# EAGLE design PCI dos Motores (EAGLE 6.3)
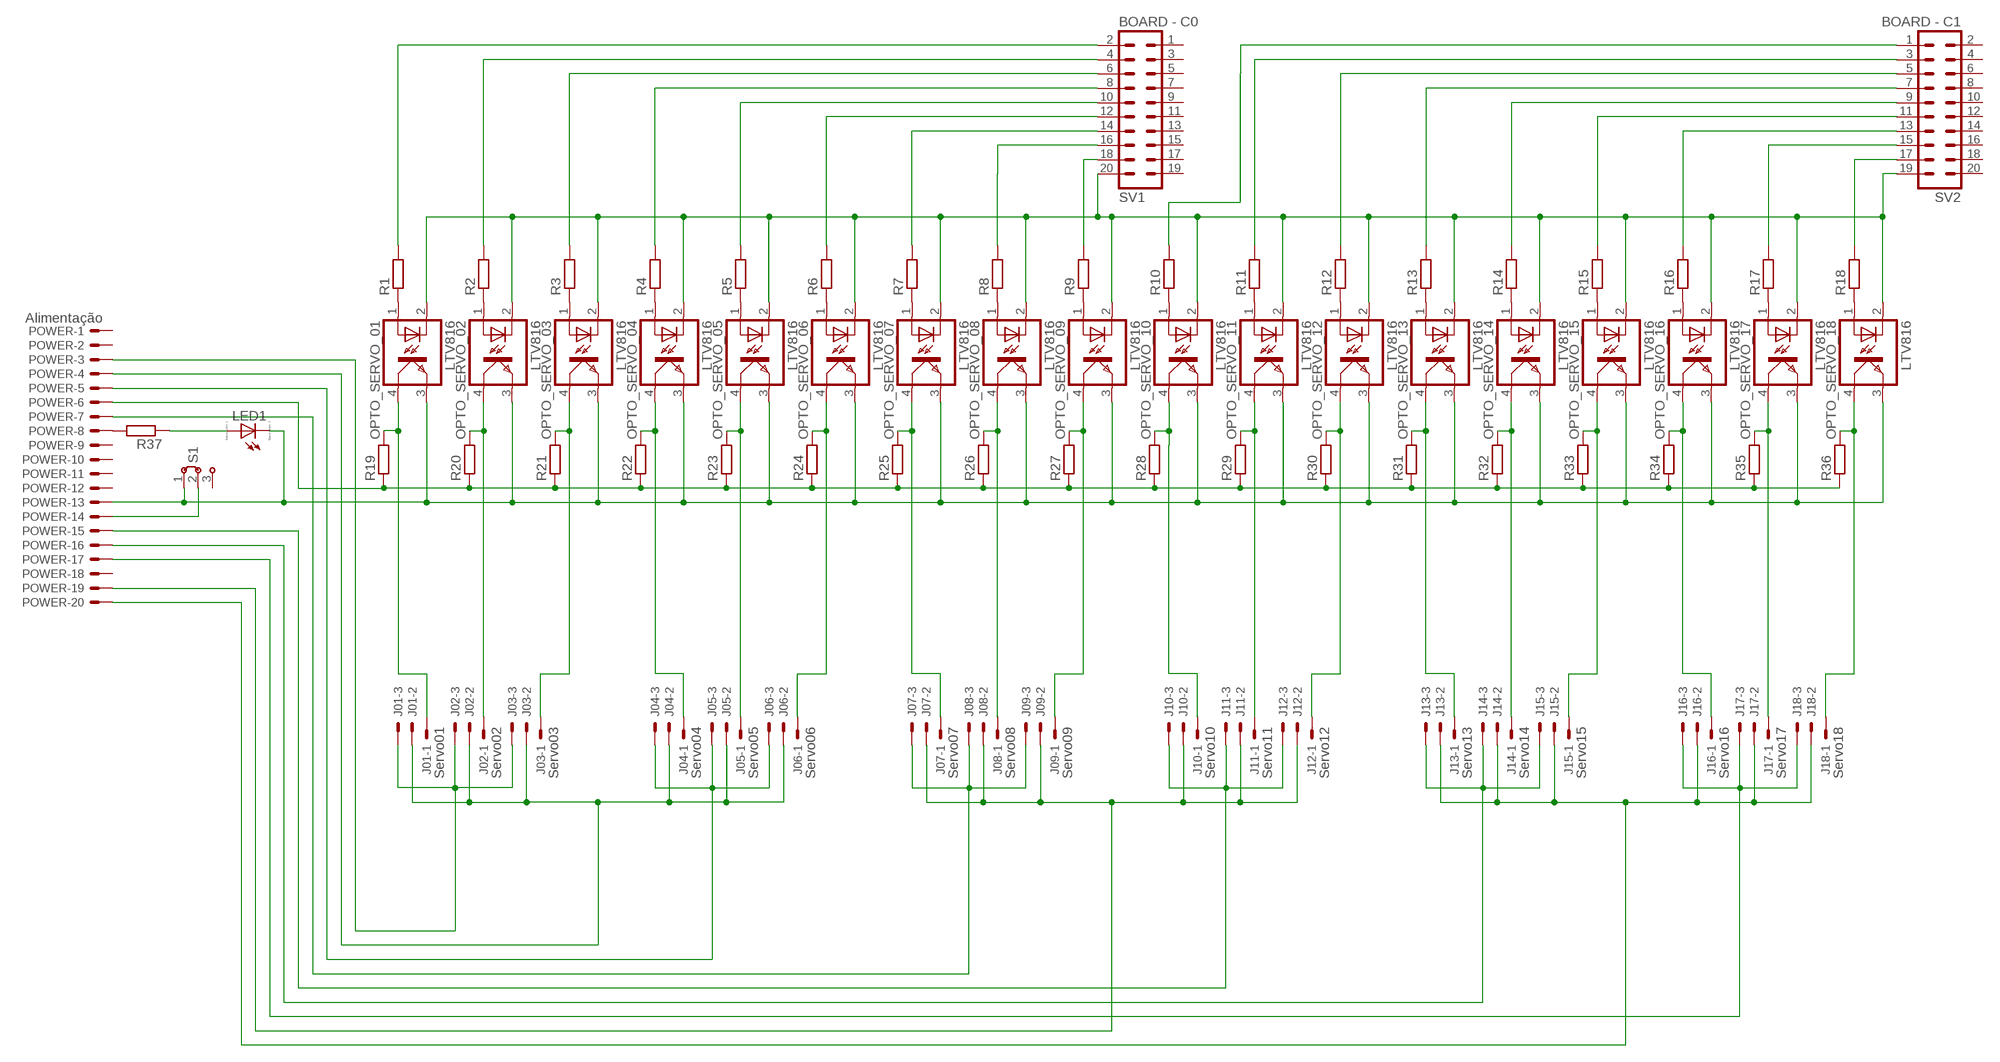
[diagram p0: schematic, sheet 1]

## Parts
J01  Servo01  22-05-7038-03  [7395-03]
J02  Servo02  22-05-7038-03  [7395-03]
J03  Servo03  22-05-7038-03  [7395-03]
J04  Servo04  22-05-7038-03  [7395-03]
J05  Servo05  22-05-7038-03  [7395-03]
J06  Servo06  22-05-7038-03  [7395-03]
J07  Servo07  22-05-7038-03  [7395-03]
J08  Servo08  22-05-7038-03  [7395-03]
J09  Servo09  22-05-7038-03  [7395-03]
J10  Servo10  22-05-7038-03  [7395-03]
J11  Servo11  22-05-7038-03  [7395-03]
J12  Servo12  22-05-7038-03  [7395-03]
J13  Servo13  22-05-7038-03  [7395-03]
J14  Servo14  22-05-7038-03  [7395-03]
J15  Servo15  22-05-7038-03  [7395-03]
J16  Servo16  22-05-7038-03  [7395-03]
J17  Servo17  22-05-7038-03  [7395-03]
J18  Servo18  22-05-7038-03  [7395-03]
LED1  LED_ELD260  [LED_LD260]
OPTO_SERVO_01  LTV816  [DIL04]
OPTO_SERVO_02  LTV816  [DIL04]
OPTO_SERVO_03  LTV816  [DIL04]
OPTO_SERVO_04  LTV816  [DIL04]
OPTO_SERVO_05  LTV816  [DIL04]
OPTO_SERVO_06  LTV816  [DIL04]
OPTO_SERVO_07  LTV816  [DIL04]
OPTO_SERVO_08  LTV816  [DIL04]
OPTO_SERVO_09  LTV816  [DIL04]
OPTO_SERVO_10  LTV816  [DIL04]
OPTO_SERVO_11  LTV816  [DIL04]
OPTO_SERVO_12  LTV816  [DIL04]
OPTO_SERVO_13  LTV816  [DIL04]
OPTO_SERVO_14  LTV816  [DIL04]
OPTO_SERVO_15  LTV816  [DIL04]
OPTO_SERVO_16  LTV816  [DIL04]
OPTO_SERVO_17  LTV816  [DIL04]
OPTO_SERVO_18  LTV816  [DIL04]
POWER  Alimentação  5566-20  [5566-20]
R1  R-EU_0309/10  [0309/10]
R2  R-EU_0309/10  [0309/10]
R3  R-EU_0309/10  [0309/10]
R4  R-EU_0309/10  [0309/10]
R5  R-EU_0309/10  [0309/10]
R6  R-EU_0309/10  [0309/10]
R7  R-EU_0309/10  [0309/10]
R8  R-EU_0309/10  [0309/10]
R9  R-EU_0309/10  [0309/10]
R10  R-EU_0309/10  [0309/10]
R11  R-EU_0309/10  [0309/10]
R12  R-EU_0309/10  [0309/10]
R13  R-EU_0309/10  [0309/10]
R14  R-EU_0309/10  [0309/10]
R15  R-EU_0309/10  [0309/10]
R16  R-EU_0309/10  [0309/10]
R17  R-EU_0309/10  [0309/10]
R18  R-EU_0309/10  [0309/10]
R19  R-EU_0309/10  [0309/10]
R20  R-EU_0309/10  [0309/10]
R21  R-EU_0309/10  [0309/10]
R22  R-EU_0309/10  [0309/10]
R23  R-EU_0309/10  [0309/10]
R24  R-EU_0309/10  [0309/10]
R25  R-EU_0309/10  [0309/10]
R26  R-EU_0309/10  [0309/10]
R27  R-EU_0309/10  [0309/10]
R28  R-EU_0309/10  [0309/10]
R29  R-EU_0309/10  [0309/10]
R30  R-EU_0309/10  [0309/10]
R31  R-EU_0309/10  [0309/10]
R32  R-EU_0309/10  [0309/10]
R33  R-EU_0309/10  [0309/10]
R34  R-EU_0309/10  [0309/10]
R35  R-EU_0309/10  [0309/10]
R36  R-EU_0309/10  [0309/10]
R37  R-EU_0309/10  [0309/10]
S1  J2X2MM  [04C]
SV1  BOARD - C0  ML20  [ML20]
SV2  BOARD - C1  ML20  [ML20]

## Nets
N$1: OPTO_SERVO_01.1(A) R1.1
N$2: OPTO_SERVO_02.1(A) R2.1
N$3: OPTO_SERVO_03.1(A) R3.1
N$4: OPTO_SERVO_04.1(A) R4.1
N$5: OPTO_SERVO_05.1(A) R5.1
N$6: OPTO_SERVO_06.1(A) R6.1
N$7: OPTO_SERVO_07.1(A) R7.1
N$8: OPTO_SERVO_08.1(A) R8.1
N$9: OPTO_SERVO_09.1(A) R9.1
N$10: J01.1 OPTO_SERVO_01.4(COL) R19.2
N$11: OPTO_SERVO_10.1(A) R10.1
N$12: OPTO_SERVO_11.1(A) R11.1
N$13: R18.2 SV2.17
N$14: OPTO_SERVO_12.1(A) R12.1
N$15: OPTO_SERVO_13.1(A) R13.1
N$16: OPTO_SERVO_14.1(A) R14.1
N$17: OPTO_SERVO_15.1(A) R15.1
N$18: OPTO_SERVO_16.1(A) R16.1
N$19: OPTO_SERVO_17.1(A) R17.1
N$20: OPTO_SERVO_18.1(A) R18.1
N$21: J02.1 OPTO_SERVO_02.4(COL) R20.2
N$22: J03.1 OPTO_SERVO_03.4(COL) R21.2
N$23: J04.1 OPTO_SERVO_04.4(COL) R22.2
N$24: J05.1 OPTO_SERVO_05.4(COL) R23.2
N$25: J06.1 OPTO_SERVO_06.4(COL) R24.2
N$26: J07.1 OPTO_SERVO_07.4(COL) R25.2
N$27: J18.1 OPTO_SERVO_18.4(COL) R36.2
N$28: J08.1 OPTO_SERVO_08.4(COL) R26.2
N$29: J09.1 OPTO_SERVO_09.4(COL) R27.2
N$30: J11.1 OPTO_SERVO_11.4(COL) R29.2
N$31: J10.1 OPTO_SERVO_10.4(COL) R28.2
N$32: J12.1 OPTO_SERVO_12.4(COL) R30.2
N$33 [GND PWR HIGH POT]: POWER.6 R19.1 R20.1 R21.1 R22.1 R23.1 R24.1 R25.1 R26.1 R27.1 R28.1 R29.1 R30.1 R31.1 R32.1 R33.1 R34.1 R35.1 R36.1
N$34: J16.1 OPTO_SERVO_16.4(COL) R34.2
N$35: J15.1 OPTO_SERVO_15.4(COL) R33.2
N$36: J14.1 OPTO_SERVO_14.4(COL) R32.2
N$37: J13.1 OPTO_SERVO_13.4(COL) R31.2
N$38 [GND PWR HIGH POT]: LED1.K(C) OPTO_SERVO_01.3(EMIT) OPTO_SERVO_02.3(EMIT) OPTO_SERVO_03.3(EMIT) OPTO_SERVO_04.3(EMIT) OPTO_SERVO_05.3(EMIT) OPTO_SERVO_06.3(EMIT) OPTO_SERVO_07.3(EMIT) OPTO_SERVO_08.3(EMIT) OPTO_SERVO_09.3(EMIT) OPTO_SERVO_10.3(EMIT) OPTO_SERVO_11.3(EMIT) OPTO_SERVO_12.3(EMIT) OPTO_SERVO_13.3(EMIT) OPTO_SERVO_14.3(EMIT) OPTO_SERVO_15.3(EMIT) OPTO_SERVO_16.3(EMIT) OPTO_SERVO_17.3(EMIT) OPTO_SERVO_18.3(EMIT) POWER.13 S1.1
N$39 [VCC PWR HGH POT]: J01.2 J02.2 J03.2 J04.2 J05.2 J06.2 POWER.4
N$40 [VCC PWR HGH POT]: J07.2 J08.2 J09.2 J10.2 J11.2 J12.2 POWER.19
N$41 [VCC PWR HGH POT]: J13.2 J14.2 J15.2 J16.2 J17.2 J18.2 POWER.20
N$42 [GND PWR HIGH POT]: J01.3 J02.3 J03.3 POWER.3
N$43: POWER.8 R37.2
N$44 [GND PWR HIGH POT]: J07.3 J08.3 J09.3 POWER.7
N$45 [GND PWR HIGH POT]: J10.3 J11.3 J12.3 POWER.15
N$46 [GND PWR HIGH POT]: J13.3 J14.3 J15.3 POWER.16
N$47 [GND PWR HIGH POT]: J16.3 J17.3 J18.3 POWER.17
N$48 [GND BOARD]: OPTO_SERVO_01.2(C) OPTO_SERVO_02.2(C) OPTO_SERVO_03.2(C) OPTO_SERVO_04.2(C) OPTO_SERVO_05.2(C) OPTO_SERVO_06.2(C) OPTO_SERVO_07.2(C) OPTO_SERVO_08.2(C) OPTO_SERVO_09.2(C) OPTO_SERVO_10.2(C) OPTO_SERVO_11.2(C) OPTO_SERVO_12.2(C) OPTO_SERVO_13.2(C) OPTO_SERVO_14.2(C) OPTO_SERVO_15.2(C) OPTO_SERVO_16.2(C) OPTO_SERVO_17.2(C) OPTO_SERVO_18.2(C) SV1.20 SV2.19
N$49: LED1.A R37.1
N$50: R1.2 SV1.2
N$51 [GND PWR HIGH POT]: J04.3 J05.3 J06.3 POWER.5
N$52: POWER.14 S1.2
N$53: R2.2 SV1.4
N$54: R9.2 SV1.18
N$55: R8.2 SV1.16
N$56: R7.2 SV1.14
N$57: R6.2 SV1.12
N$58: R5.2 SV1.10
N$59: R4.2 SV1.8
N$60: R3.2 SV1.6
N$61: J17.1 OPTO_SERVO_17.4(COL) R35.2
N$62: R17.2 SV2.15
N$63: R16.2 SV2.13
N$64: R15.2 SV2.11
N$65: R14.2 SV2.9
N$66: R13.2 SV2.7
N$67: R12.2 SV2.5
N$68: R11.2 SV2.3
N$69: R10.2 SV2.1
Unconnected: POWER.1 POWER.2 POWER.9 POWER.10 POWER.11 POWER.12 POWER.18 S1.3 SV1.1 SV1.3 SV1.5 SV1.7 SV1.9 SV1.11 SV1.13 SV1.15 SV1.17 SV1.19 SV2.2 SV2.4 SV2.6 SV2.8 SV2.10 SV2.12 SV2.14 SV2.16 SV2.18 SV2.20

## Library data of the parts
J01-J09 J10-J18 = con-molex:22-?-03: CONNECTOR wire to board 2.54 mm (.1 inch) pitch header; OC_FARNELL: unknown; OC_NEWARK: unknown
LED1 = eagle-ltspice:LED_E: LED Source: http://www.osram.convergy.de Source: www.luxeon.com Source: www.kingbright.com; SPICEMODEL: NONE; SPICEPREFIX: D; SPICETYPE: diode
OPTO_SERVO_01-OPTO_SERVO_09 OPTO_SERVO_10-OPTO_SERVO_18 = optocoupler:LTV816: OPTO COUPLER Source: LITEON, LTV816.pdf; OC_FARNELL: unknown; OC_NEWARK: unknown
POWER = con-molex:5566-20: Mini FIT connector 20 pol ATX PC-Motherboard Power connector Source: http://www.molex.com; OC_FARNELL: unknown; OC_NEWARK: unknown
R1-R37 = rcl:R-EU_: RESISTOR, European symbol; RESISTENCE: 1K
S1 = jumper:J2: Jumper switch 2 x 2.5 mm
SV1 SV2 = con-harting-ml:ML20: HARTING; OC_FARNELL: unknown; OC_NEWARK: unknown

## Net classes
1 VCC PWR HGH POT: width 2.286 mm
2 GND BOARD: width 0.254 mm
3 GND PWR HIGH POT: width 1.016 mm

## Board
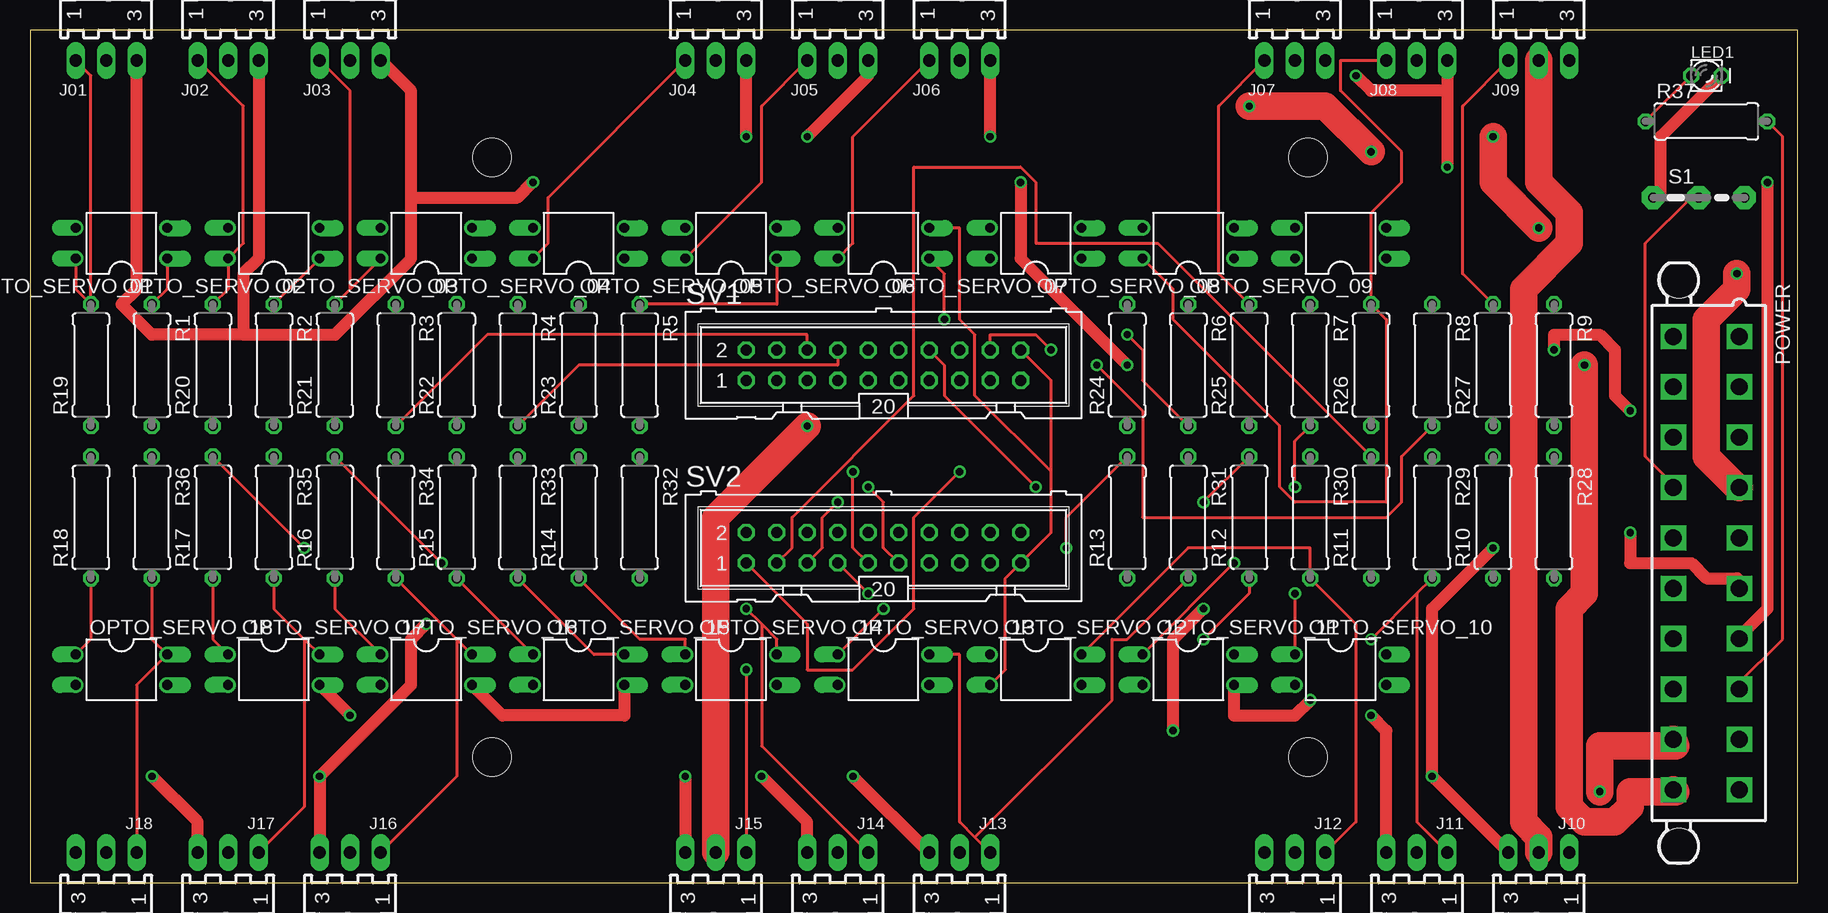
[diagram p1: board, top side]
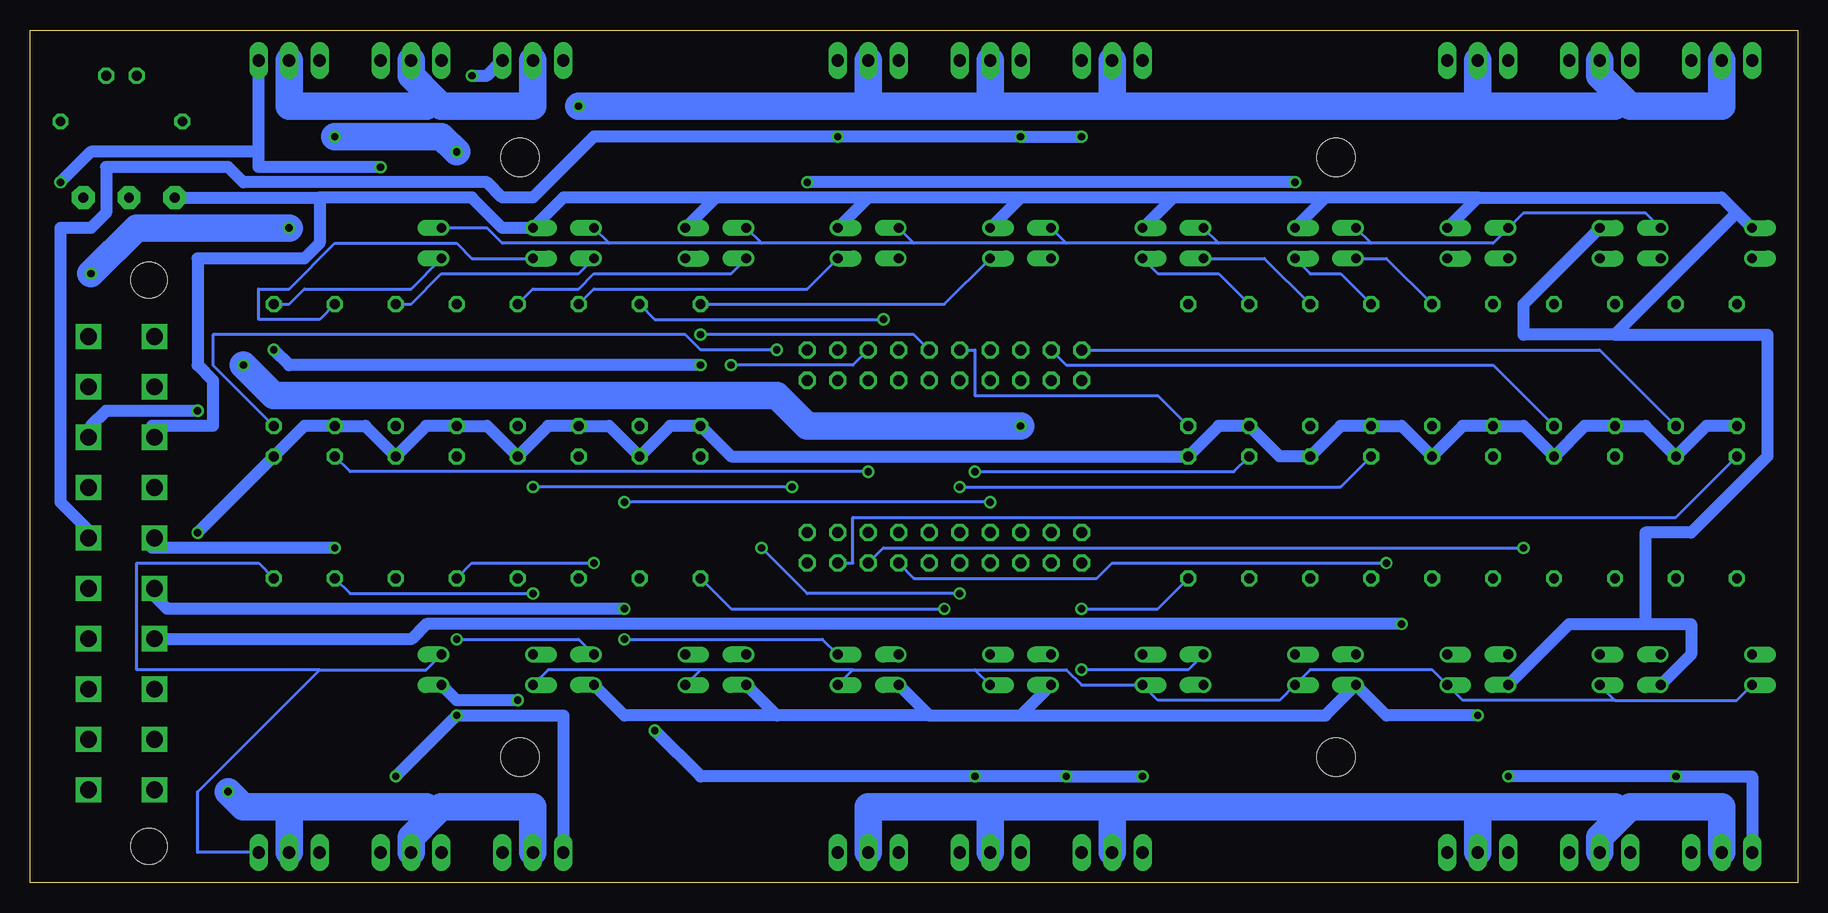
[diagram p2: board, bottom side, seen from below]

Size 147.32 x 71.12 mm. Coordinates in mm from the lower left corner, seen from the top.
Outline: 0,0 147.32,0 147.32,71.12 0,71.12 0,0
Copper layers (1*16): Top 0.05mm / dielectric 1.5mm / Bottom 0.05mm
Design rules "default *": minimum track width 10mil, minimum drill 24mil, track to track 8mil, track to pad 8mil, pad to pad 8mil, via to via 8mil, smd to smd 8mil, copper to edge 40mil, drill to drill 8mil, minimum pad ring 10mil, minimum via ring 8mil, stop-mask expansion 4mil, vias tented up to drill 0mil, thermal gap 10mil
Holes 3.2 mm at 106.5,10.5 38.5,10.5 38.5,60.5 106.5,60.5

### Footprints (pad centres in the part's own frame; a part is rotated, then mirrored left to right if it is on the bottom)
7395-03 = drill 1.016 long: 1 2.54,0; 2 0,0; 3 -2.54,0
LED_LD260 = drill 0.813 octagon: A -1.27,0; K 1.27,0
DIL04 = drill 0.813 offset: 1 -1.27,-3.81; 2 1.27,-3.81; 3 1.27,3.81; 4 -1.27,3.81
5566-20 = drill 1.4 square: 1 18.9,-2.75; 2 14.7,-2.75; 3 10.5,-2.75; 4 6.3,-2.75; 5 2.1,-2.75; 6 -2.1,-2.75; 7 -6.3,-2.75; 8 -10.5,-2.75; 9 -14.7,-2.75; 10 -18.9,-2.75; 11 18.9,2.75; 12 14.7,2.75; 13 10.5,2.75; 14 6.3,2.75; 15 2.1,2.75; 16 -2.1,2.75; 17 -6.3,2.75; 18 -10.5,2.75; 19 -14.7,2.75; 20 -18.9,2.75 | hole 3: 23.6,2.29; -23.6,2.29
0309/10 = drill 0.813 octagon: 1 -5.08,0; 2 5.08,0
04C = drill 0.813 pad 1.905 octagon: 1 -1.905,0; 2 1.905,0; 3 5.715,0
ML20 = drill 0.914 octagon: 1 -11.43,-1.27; 2 -11.43,1.27; 3 -8.89,-1.27; 4 -8.89,1.27; 5 -6.35,-1.27; 6 -6.35,1.27; 7 -3.81,-1.27; 8 -3.81,1.27; 9 -1.27,-1.27; 10 -1.27,1.27; 11 1.27,-1.27; 12 1.27,1.27; 13 3.81,-1.27; 14 3.81,1.27; 15 6.35,-1.27; 16 6.35,1.27; 17 8.89,-1.27; 18 8.89,1.27; 19 11.43,-1.27; 20 11.43,1.27

### Placement (x,y rotation side)
J01  6.35,68.58 180 top
J02  16.51,68.58 180 top
J03  26.67,68.58 180 top
J04  57.15,68.58 180 top
J05  67.31,68.58 180 top
J06  77.47,68.58 180 top
J07  105.41,68.58 180 top
J08  115.57,68.58 180 top
J09  125.73,68.58 180 top
J10  125.73,2.54 0 top
J11  115.57,2.54 0 top
J12  105.41,2.54 0 top
J13  77.47,2.54 0 top
J14  67.31,2.54 0 top
J15  57.15,2.54 0 top
J16  26.67,2.54 0 top
J17  16.51,2.54 0 top
J18  6.35,2.54 0 top
LED1  139.7,67.31 0 top
OPTO_SERVO_01  7.62,53.34 90 top
OPTO_SERVO_02  20.32,53.34 90 top
OPTO_SERVO_03  33.02,53.34 90 top
OPTO_SERVO_04  45.72,53.34 90 top
OPTO_SERVO_05  58.42,53.34 90 top
OPTO_SERVO_06  71.12,53.34 90 top
OPTO_SERVO_07  83.82,53.34 90 top
OPTO_SERVO_08  96.52,53.34 90 top
OPTO_SERVO_09  109.22,53.34 90 top
OPTO_SERVO_10  109.22,17.78 270 top
OPTO_SERVO_11  96.52,17.78 270 top
OPTO_SERVO_12  83.82,17.78 270 top
OPTO_SERVO_13  71.12,17.78 270 top
OPTO_SERVO_14  58.42,17.78 270 top
OPTO_SERVO_15  45.72,17.78 270 top
OPTO_SERVO_16  33.02,17.78 270 top
OPTO_SERVO_17  20.32,17.78 270 top
OPTO_SERVO_18  7.62,17.78 270 top
POWER  139.7,26.67 90 top
R1  10.16,43.18 270 top
R2  20.32,43.18 270 top
R3  30.48,43.18 270 top
R4  40.64,43.18 270 top
R5  50.8,43.18 270 top
R6  96.52,43.18 270 top
R7  106.68,43.18 270 top
R8  116.84,43.18 270 top
R9  127,43.18 270 top
R10  121.92,30.48 90 top
R11  111.76,30.48 90 top
R12  101.6,30.48 90 top
R13  91.44,30.48 90 top
R14  45.72,30.48 90 top
R15  35.56,30.48 90 top
R16  25.4,30.48 90 top
R17  15.24,30.48 90 top
R18  5.08,30.48 90 top
R19  5.08,43.18 90 top
R20  15.24,43.18 90 top
R21  25.4,43.18 90 top
R22  35.56,43.18 90 top
R23  45.72,43.18 90 top
R24  91.44,43.18 90 top
R25  101.6,43.18 90 top
R26  111.76,43.18 90 top
R27  121.92,43.18 90 top
R28  127,30.48 270 top
R29  116.84,30.48 270 top
R30  106.68,30.48 270 top
R31  96.52,30.48 270 top
R32  50.8,30.48 270 top
R33  40.64,30.48 270 top
R34  30.48,30.48 270 top
R35  20.32,30.48 270 top
R36  10.16,30.48 270 top
R37  139.7,63.5 0 top
S1  137.16,57.15 0 top
SV1  71.12,43.18 0 top
SV2  71.12,27.94 0 top

### Tracks (layer width: path | path; a pad name or v marks a point on that pad's centre or on a via)
N$1
  Top 0.254: R1.1 11.43,49.53 OPTO_SERVO_01.1
N$2
  Top 0.254: OPTO_SERVO_02.1 R2.1
N$3
  Bottom 0.254: R3.1 34.29,52.07 OPTO_SERVO_03.1
N$4
  Bottom 0.254: R4.1 44.45,52.07 OPTO_SERVO_04.1
N$5
  Top 0.254: R5.1 62.23,48.26 OPTO_SERVO_05.1
N$6  (via drill 0.61)
  Top 0.254: OPTO_SERVO_06.1 76.2,50.8 v76.2,46.99
  Bottom 0.254: v76.2,46.99 95.25,46.99 R6.1
N$7
  Bottom 0.254: OPTO_SERVO_07.1 88.9,50.8 100.33,50.8 101.6,49.53 105.41,49.53 R7.1
N$8
  Bottom 0.254: OPTO_SERVO_08.1 101.6,50.8 113.03,50.8 115.57,48.26 R8.1
N$9
  Bottom 0.254: OPTO_SERVO_09.1 115.57,49.53 124.46,49.53 125.73,48.26 R9.1
N$10
  Top 0.254: OPTO_SERVO_01.4 3.81,49.53 R19.2 5.08,67.31 J01.1
N$11  (via drill 0.61)
  Top 0.254: v105.41,24.13 OPTO_SERVO_10.1
  Bottom 0.254: v105.41,24.13 120.65,24.13 R10.1
N$12  (via drill 0.61)
  Top 0.254: v100.33,26.67 OPTO_SERVO_11.1
  Bottom 0.254: v100.33,26.67 110.49,26.67 R11.1
N$13
  Bottom 0.254: R18.2 10.16,30.48 78.74,30.48 78.74,26.67 SV2.17
N$14  (via drill 0.61)
  Top 0.254: v97.79,20.32 101.6,24.13 R12.1
  Bottom 0.254: OPTO_SERVO_12.1 81.28,20.32 v97.79,20.32
N$15  (via drill 0.61)
  Top 0.254: v71.12,22.86 OPTO_SERVO_13.1
  Bottom 0.254: v71.12,22.86 88.9,22.86 R13.1
N$16
  Top 0.254: R14.1 50.8,20.32 54.61,20.32 OPTO_SERVO_14.1
N$17
  Top 0.254: R15.1 OPTO_SERVO_15.1
N$18
  Top 0.254: OPTO_SERVO_16.1 25.4,22.86 R16.1
N$19
  Top 0.254: OPTO_SERVO_17.1 15.24,20.32 R17.1
N$20
  Top 0.254: OPTO_SERVO_18.1 5.08,20.32 R18.1
N$21
  Top 0.254: R20.2 16.51,49.53 OPTO_SERVO_02.4 17.78,53.34 17.78,64.77 J02.1
N$22
  Top 0.254: OPTO_SERVO_03.4 26.67,49.53 | 26.67,49.53 R21.2 | J03.1 26.67,66.04 26.67,49.53
N$23
  Top 0.254: J04.1 43.18,57.15 43.18,53.34 OPTO_SERVO_04.4
  Bottom 0.254: R22.2 38.1,50.8 40.64,50.8 OPTO_SERVO_04.4
N$24
  Top 0.254: J05.1 60.96,64.77 60.96,58.42 OPTO_SERVO_05.4
  Bottom 0.254: R23.2 48.26,50.8 53.34,50.8 OPTO_SERVO_05.4
N$25
  Top 0.254: J06.1 68.58,62.23 68.58,53.34 OPTO_SERVO_06.4
  Bottom 0.254: OPTO_SERVO_06.4 71.12,48.26 R24.2
N$26
  Top 0.254: J07.1 99.06,64.77 99.06,50.8 R25.2
  Bottom 0.254: OPTO_SERVO_07.4 82.55,49.53 100.33,49.53 R25.2
N$27
  Top 0.254: R36.2 10.16,20.32 OPTO_SERVO_18.4 8.89,16.51 J18.1
N$28
  Top 0.254: OPTO_SERVO_08.4 95.25,49.53 95.25,46.99 104.14,38.1 104.14,33.02 105.41,31.75 113.03,31.75 113.03,46.99 R26.2 111.76,55.88 114.3,58.42 114.3,60.96 109.22,66.04 109.22,68.58 J08.1
N$29
  Top 0.254: J09.1 119.38,64.77 119.38,50.8 R27.2
  Bottom 0.254: OPTO_SERVO_09.4 110.49,52.07 111.76,53.34 121.92,53.34 125.73,49.53 128.27,49.53 128.27,46.99 123.19,46.99 R27.2
N$30  (via drill 0.61)
  Top 0.254: R29.2 115.57,24.13 | 115.57,24.13 v111.76,20.32 | J11.1 115.57,5.08 115.57,24.13
  Bottom 0.254: OPTO_SERVO_11.4 101.6,20.32 v111.76,20.32
N$31
  Bottom 0.254: OPTO_SERVO_10.4 114.3,17.78 123.19,17.78 | 123.19,17.78 133.35,7.62 133.35,2.54 J10.1 | R28.2 128.27,26.67 138.43,26.67 138.43,17.78 123.19,17.78
N$32
  Top 0.254: OPTO_SERVO_12.4 96.52,27.94 106.68,27.94 R30.2 110.49,21.59 110.49,5.08 J12.1
N$33  (via drill 0.61)
  Top 1.016: v133.35,29.21 133.35,26.67 138.43,26.67 139.7,25.4 142.24,25.4 POWER.6
  Bottom 1.016: R19.1 7.62,38.1 R36.1 12.7,38.1 R20.1 17.78,38.1 R35.1 22.86,38.1 R21.1 27.94,38.1 R34.1 33.02,38.1 R22.1 38.1,38.1 R33.1 43.18,35.56 R23.1 48.26,38.1 R32.1 88.9,35.56 R24.1 93.98,38.1 R31.1 99.06,38.1 R25.1 104.14,38.1 R30.1 109.22,38.1 R26.1 114.3,38.1 R29.1 119.38,38.1 R27.1 124.46,38.1 R28.1 v133.35,29.21
N$34
  Top 0.254: R34.2 35.56,20.32 | 35.56,20.32 OPTO_SERVO_16.4 | J16.1 35.56,8.89 35.56,20.32
N$35  (via drill 0.61)
  Top 0.254: R33.2 46.99,19.05 OPTO_SERVO_15.4 | v59.69,17.78 J15.1
  Bottom 0.254: v59.69,17.78 50.8,17.78 OPTO_SERVO_15.4
N$36  (via drill 0.61)
  Top 0.254: 60.96,21.59 62.23,20.32 OPTO_SERVO_14.4 | 60.96,21.59 v59.69,22.86 | J14.1 60.96,11.43 60.96,21.59
  Bottom 0.254: R32.2 53.34,22.86 v59.69,22.86
N$37
  Top 0.254: OPTO_SERVO_13.4 77.47,19.05 77.47,5.08 78.74,3.81 | J13.1 78.74,3.81 | R31.2 91.44,20.32 90.17,20.32 90.17,15.24 78.74,3.81
N$38  (via drill 0.61)
  Top 1.016: OPTO_SERVO_16.3 39.37,13.97 49.53,13.97 OPTO_SERVO_15.3 | v106.68,15.24 105.41,13.97 100.33,13.97 OPTO_SERVO_11.3 | LED1.K 135.89,62.23 135.89,57.15 S1.1 | OPTO_SERVO_17.3 v26.67,13.97
  Bottom 1.016: 64.77,13.97 OPTO_SERVO_14.3 | 72.39,13.97 64.77,13.97 | OPTO_SERVO_13.3 72.39,13.97 | 85.09,13.97 OPTO_SERVO_12.3 | 72.39,13.97 85.09,13.97 | OPTO_SERVO_11.3 97.79,13.97 85.09,13.97 | OPTO_SERVO_10.3 111.76,15.24 v106.68,15.24 | 64.77,13.97 39.37,13.97 OPTO_SERVO_16.3 34.29,13.97 v26.67,13.97 | 123.19,57.15 123.19,53.34 124.46,52.07 133.35,52.07 133.35,43.18 132.08,41.91 132.08,38.1 137.16,38.1 POWER.13 | S1.1 123.19,57.15 | OPTO_SERVO_18.3 8.89,19.05 8.89,21.59 12.7,21.59 | 12.7,21.59 19.05,21.59 OPTO_SERVO_17.3 | 5.08,55.88 6.35,57.15 26.67,57.15 | 5.08,55.88 OPTO_SERVO_01.3 | OPTO_SERVO_03.3 26.67,57.15 | OPTO_SERVO_02.3 22.86,48.26 22.86,45.72 15.24,45.72 | 5.08,55.88 15.24,45.72 | 39.37,57.15 OPTO_SERVO_04.3 | 26.67,57.15 39.37,57.15 | 52.07,57.15 OPTO_SERVO_05.3 | 39.37,57.15 52.07,57.15 | 64.77,57.15 OPTO_SERVO_06.3 | 52.07,57.15 64.77,57.15 | 77.47,57.15 OPTO_SERVO_07.3 | 64.77,57.15 77.47,57.15 | 90.17,57.15 OPTO_SERVO_08.3 | 77.47,57.15 90.17,57.15 | 90.17,57.15 102.87,57.15 OPTO_SERVO_09.3 107.95,54.61 110.49,57.15 123.19,57.15 | 12.7,21.59 12.7,29.21 8.89,29.21 2.54,35.56 2.54,45.72 15.24,45.72
N$39  (via drill 0.61)
  Top 2.286: v142.24,50.8 142.24,49.53 139.7,46.99 139.7,35.56 142.24,33.02 POWER.4 | v125.73,54.61 121.92,58.42 v121.92,62.23 | v111.76,60.96 107.95,64.77 v101.6,64.77
  Bottom 2.286: J01.2 6.35,64.77 13.97,64.77 14.61,65.41 | 14.61,65.41 16.51,67.31 J02.2 | 26.67,64.77 J03.2 | 26.67,64.77 15.24,64.77 14.61,65.41 | 57.15,64.77 J04.2 | 26.67,64.77 57.15,64.77 | 67.31,64.77 J05.2 | 57.15,64.77 67.31,64.77 | 77.47,64.77 J06.2 | 67.31,64.77 77.47,64.77 | v142.24,50.8 138.43,54.61 v125.73,54.61 | v121.92,62.23 113.03,62.23 v111.76,60.96 | 77.47,64.77 v101.6,64.77
N$40  (via drill 0.61)
  Top 2.286: v130.81,7.62 130.81,11.43 137.16,11.43 POWER.19 | J09.2 125.73,58.42 128.27,55.88 128.27,53.34 124.46,49.53 124.46,5.08 125.73,3.81 J10.2
  Bottom 2.286: J07.2 105.41,64.77 113.03,64.77 113.67,65.41 | 113.67,65.41 115.57,67.31 J08.2 | J09.2 125.73,64.77 114.3,64.77 113.67,65.41 | J12.2 105.41,6.35 113.03,6.35 113.67,5.71 | 113.67,5.71 115.57,3.81 J11.2 | 125.73,6.35 J10.2 | 125.73,6.35 114.3,6.35 113.67,5.71 | v130.81,7.62 129.54,6.35 125.73,6.35
N$41  (via drill 0.61)
  Top 2.286: v129.54,43.18 129.54,24.13 128.27,22.86 128.27,6.35 129.54,5.08 132.08,5.08 133.35,6.35 133.35,7.62 137.16,7.62 POWER.20 | v64.77,38.1 57.15,30.48 J15.2
  Bottom 2.286: J18.2 6.35,6.35 13.97,6.35 14.61,5.71 | 14.61,5.71 16.51,3.81 J17.2 | 26.67,6.35 J16.2 | 26.67,6.35 15.24,6.35 14.61,5.71 | 57.15,6.35 J15.2 | 26.67,6.35 57.15,6.35 | 67.31,6.35 J14.2 | 57.15,6.35 67.31,6.35 | J13.2 77.47,6.35 67.31,6.35 | v129.54,43.18 127,40.64 85.09,40.64 82.55,38.1 v64.77,38.1
N$42  (via drill 0.61)
  Top 1.016: J01.3 8.89,49.53 7.62,48.26 10.16,45.72 17.78,45.72 | 17.78,45.72 17.78,50.8 19.05,52.07 J02.3 | J03.3 31.75,66.04 31.75,57.15 | 31.75,57.15 31.75,52.07 25.4,45.72 17.78,45.72 | v133.35,39.37 132.08,40.64 132.08,44.45 130.81,45.72 127,45.72 v127,44.45 | v91.44,43.18 82.55,52.07 v82.55,58.42 | v41.91,58.42 40.64,57.15 31.75,57.15
  Bottom 1.016: v133.35,39.37 140.97,39.37 142.24,38.1 POWER.3 | v127,44.45 125.73,43.18 v91.44,43.18 | v41.91,58.42 v82.55,58.42
N$43
  Top 0.254: R37.2 146.05,62.23 146.05,20.32 142.24,16.51 POWER.8
N$44  (via drill 0.61)
  Top 1.016: v110.49,67.31 111.76,66.04 118.11,66.04 | J08.3 118.11,66.04 | 118.11,66.04 v118.11,59.69 | v144.78,58.42 144.78,22.86 142.24,20.32 POWER.7
  Bottom 1.016: J07.3 109.22,67.31 v110.49,67.31 | 128.27,60.96 128.27,59.69 v118.11,59.69 | 128.27,60.96 J09.3 | v144.78,58.42 142.24,60.96 128.27,60.96
N$45  (via drill 0.61)
  Top 1.016: v111.76,13.97 113.03,12.7 J11.3 | J10.3 v116.84,8.89 116.84,22.86 v121.92,27.94
  Bottom 1.016: J12.3 102.87,13.97 v111.76,13.97 v116.84,8.89 | v121.92,27.94 137.16,27.94 POWER.15
N$46  (via drill 0.61)
  Top 1.016: v54.61,8.89 J15.3 | v60.96,8.89 64.77,5.08 J14.3 | v68.58,8.89 J13.3 | v97.79,22.86 95.25,20.32 v95.25,12.7
  Bottom 1.016: v54.61,8.89 v60.96,8.89 v68.58,8.89 91.44,8.89 v95.25,12.7 | v97.79,22.86 135.89,22.86 137.16,24.13 POWER.16
N$47  (via drill 0.61)
  Top 1.016: v10.16,8.89 13.97,5.08 J17.3 | J16.3 v24.13,8.89 31.75,16.51 31.75,20.32 v33.02,21.59
  Bottom 1.016: J18.3 3.81,8.89 v10.16,8.89 v24.13,8.89 | v33.02,21.59 114.3,21.59 115.57,20.32 137.16,20.32 POWER.17
N$48
  Top 0.254: OPTO_SERVO_12.2 81.28,17.78 81.28,25.4 SV2.19 85.09,29.21 85.09,34.29 | SV1.20 85.09,41.91 85.09,34.29 | OPTO_SERVO_06.2 77.47,54.61 77.47,46.99 78.74,45.72 78.74,40.64 85.09,34.29
  Bottom 0.254: OPTO_SERVO_01.2 12.7,55.88 22.86,55.88 OPTO_SERVO_02.2 25.4,53.34 35.56,53.34 | 35.56,53.34 OPTO_SERVO_03.2 | 48.26,53.34 OPTO_SERVO_04.2 | 35.56,53.34 48.26,53.34 | 60.96,53.34 OPTO_SERVO_05.2 | 48.26,53.34 60.96,53.34 | 73.66,53.34 OPTO_SERVO_06.2 | 60.96,53.34 73.66,53.34 | 86.36,53.34 OPTO_SERVO_07.2 | 73.66,53.34 86.36,53.34 | 99.06,53.34 OPTO_SERVO_08.2 | 86.36,53.34 99.06,53.34 | OPTO_SERVO_09.2 109.22,54.61 107.95,53.34 99.06,53.34 | OPTO_SERVO_18.2 5.08,15.24 15.24,15.24 | OPTO_SERVO_17.2 15.24,15.24 | 15.24,15.24 27.94,15.24 OPTO_SERVO_16.2 30.48,17.78 40.64,17.78 OPTO_SERVO_15.2 43.18,15.24 53.34,15.24 OPTO_SERVO_14.2 59.69,16.51 60.96,17.78 68.58,17.78 | 68.58,17.78 OPTO_SERVO_13.2 | 78.74,17.78 68.58,17.78 | OPTO_SERVO_12.2 78.74,17.78 | 91.44,17.78 OPTO_SERVO_11.2 | 78.74,17.78 91.44,17.78 | OPTO_SERVO_10.2 104.14,17.78 91.44,17.78
N$49
  Top 0.254: LED1.A R37.1
N$50
  Bottom 0.254: R1.2 16.51,44.45 SV1.2
N$51  (via drill 0.61)
  Top 1.016: v59.69,62.23 J04.3 | v64.77,62.23 69.85,67.31 J05.3 | v80.01,62.23 J06.3
  Bottom 1.016: v59.69,62.23 v64.77,62.23 v80.01,62.23 100.33,62.23 105.41,57.15 107.95,57.15 109.22,58.42 129.54,58.42 130.81,59.69 140.97,59.69 140.97,55.88 142.24,54.61 144.78,54.61 144.78,31.75 142.24,29.21 POWER.5
N$52
  Top 0.254: S1.2 138.43,57.15 134.62,53.34 134.62,35.56 137.16,33.02 POWER.14
N$53
  Bottom 0.254: R2.2 25.4,43.18 60.96,43.18 SV1.4
N$54  (via drill 0.61)
  Top 0.254: v85.09,44.45 83.82,45.72 80.01,45.72 SV1.18
  Bottom 0.254: R9.2 132.08,43.18 132.08,45.72 92.71,45.72 91.44,44.45 v85.09,44.45
N$55  (via drill 0.61)
  Top 0.254: R8.2 114.3,35.56 114.3,31.75 113.03,30.48 92.71,30.48 92.71,39.37 v88.9,43.18
  Bottom 0.254: v88.9,43.18 78.74,43.18 SV1.16
N$56  (via drill 0.61)
  Top 0.254: R7.2 105.41,36.83 v105.41,33.02 | v83.82,33.02 76.2,40.64 76.2,43.18 SV1.14
  Bottom 0.254: v83.82,33.02 v105.41,33.02
N$57  (via drill 0.61)
  Top 0.254: R6.2 92.71,41.91 92.71,44.45 v91.44,45.72
  Bottom 0.254: v91.44,45.72 73.66,45.72 SV1.12
N$58
  Bottom 0.254: R5.2 53.34,40.64 68.58,40.64 68.58,44.45 SV1.10
N$59
  Top 0.254: R4.2 45.72,43.18 67.31,43.18 SV1.8
N$60
  Top 0.254: R3.2 38.1,45.72 64.77,45.72 SV1.6
N$61
  Top 0.254: 22.86,20.32 20.32,22.86 R35.2 | 22.86,20.32 OPTO_SERVO_17.4 | J17.1 22.86,6.35 22.86,20.32
N$62  (via drill 0.61)
  Top 0.254: v22.86,27.94 R17.2
  Bottom 0.254: v22.86,27.94 76.2,27.94 SV2.15
N$63  (via drill 0.61)
  Top 0.254: v34.29,26.67 R16.2
  Bottom 0.254: v34.29,26.67 57.15,26.67 58.42,25.4 73.66,25.4 SV2.13
N$64  (via drill 0.61)
  Top 0.254: v69.85,33.02 71.12,31.75 71.12,27.94 SV2.11
  Bottom 0.254: R15.2 38.1,33.02 v69.85,33.02
N$65  (via drill 0.61)
  Top 0.254: v68.58,34.29 68.58,27.94 SV2.9
  Bottom 0.254: R14.2 46.99,34.29 v68.58,34.29
N$66  (via drill 0.61)
  Top 0.254: R13.2 86.36,30.48 v86.36,27.94 | SV2.7 v69.85,24.13
  Bottom 0.254: v86.36,27.94 82.55,24.13 v69.85,24.13
N$67  (via drill 0.61)
  Top 0.254: v97.79,31.75 R12.2 | v67.31,31.75 66.04,30.48 66.04,27.94 SV2.5
  Bottom 0.254: v67.31,31.75 v97.79,31.75
N$68
  Top 0.254: R11.2 93.98,53.34 83.82,53.34 83.82,58.42 82.55,59.69 73.66,59.69 73.66,40.64 63.5,30.48 63.5,27.94 SV2.3
N$69  (via drill 0.61)
  Top 0.254: v77.47,34.29 73.66,30.48 73.66,22.86 68.58,17.78 64.77,17.78 64.77,21.59 SV2.1
  Bottom 0.254: R10.2 120.65,34.29 v77.47,34.29